# Altium schematic sheet Connectors.SchDoc
size A
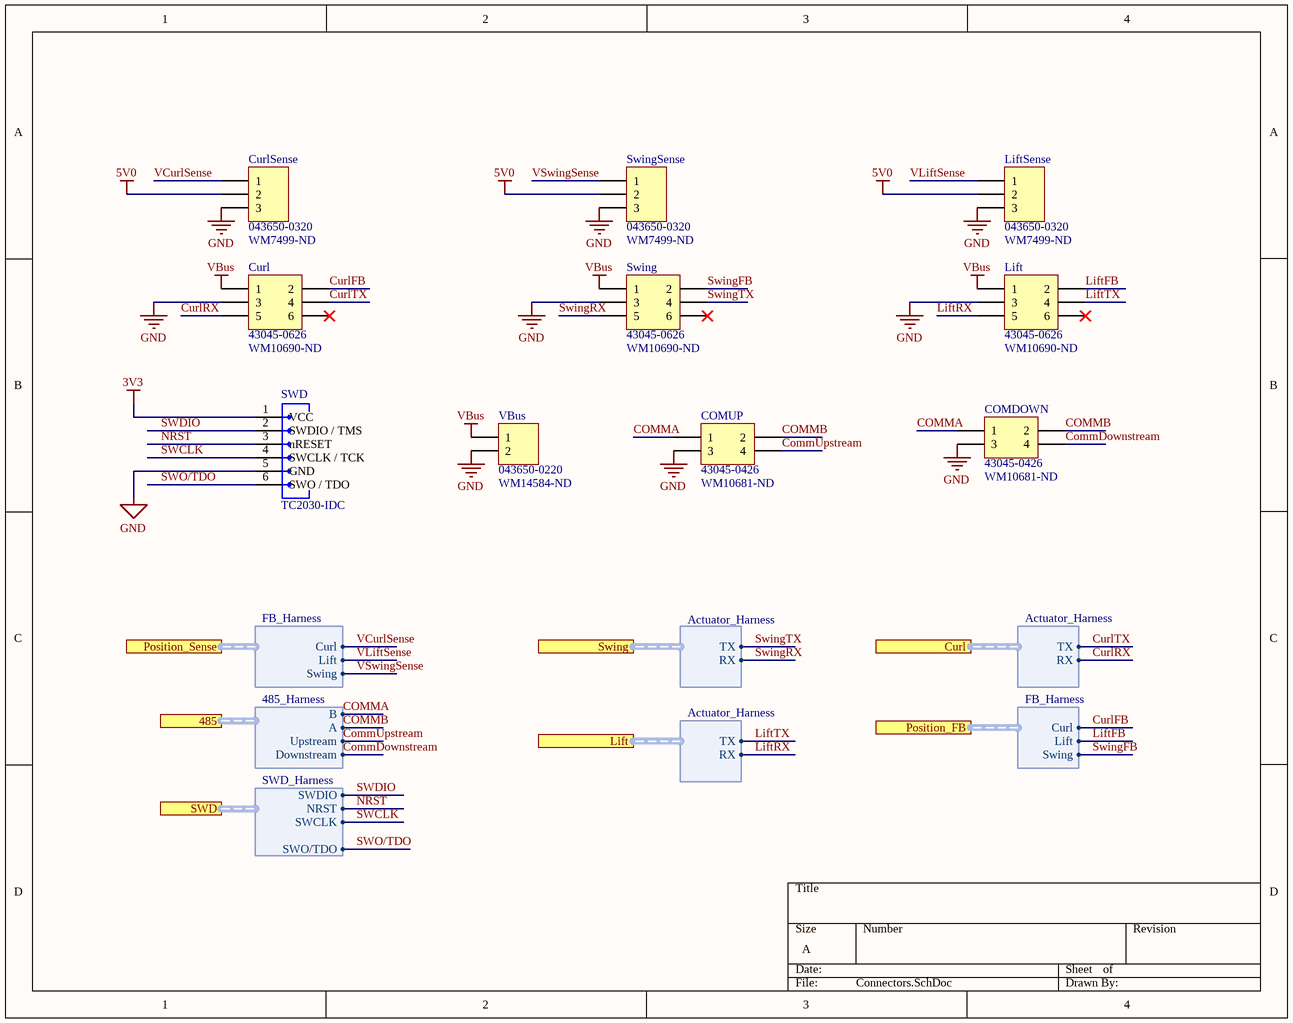
[diagram p0: Connectors.SchDoc]

## Parts
COMDOWN  43045-0426  Vendor PN: WM10681-ND  [43045-0426]
COMUP  43045-0426  Vendor PN: WM10681-ND  [43045-0426]
Curl  43045-0626  Vendor PN: WM10690-ND  [43045-0626]
CurlSense  043650-0320  Vendor PN: WM7499-ND  [43650-0320]
Lift  43045-0626  Vendor PN: WM10690-ND  [43045-0626]
LiftSense  043650-0320  Vendor PN: WM7499-ND  [43650-0320]
SWD  TC2030-IDC  [TC2030-MCP]
Swing  43045-0626  Vendor PN: WM10690-ND  [43045-0626]
SwingSense  043650-0320  Vendor PN: WM7499-ND  [43650-0320]
VBus  043650-0220  Vendor PN: WM14584-ND  [43650-0220]

## Ports
485 (harness 485_Harness), Curl (harness Actuator_Harness), Lift (harness Actuator_Harness), Position_FB (harness FB_Harness), Position_Sense (harness FB_Harness), SWD (harness SWD_Harness), Swing (harness Actuator_Harness)

## Harnesses
SWD_Harness: NRST, SWDIO, SWCLK, SWO/TDO
Actuator_Harness: RX, TX
FB_Harness: Lift, Curl, Swing
485_Harness: A, B, Upstream, Downstream

## Nets
3V3: SWD.1(VCC)
5V0: CurlSense.2 LiftSense.2 SwingSense.2
GND: COMDOWN.3 COMUP.3 Curl.3 CurlSense.3 Lift.3 LiftSense.3 SWD.5(GND) Swing.3 SwingSense.3 VBus.2
VBus: Curl.1 Lift.1 Swing.1 VBus.1
COMMA: COMDOWN.1 COMUP.1 ; port 485.B
COMMB: COMDOWN.2 COMUP.2 ; port 485.A
CommDownstream: COMDOWN.4 ; port 485.Downstream
CommUpstream: COMUP.4 ; port 485.Upstream
CurlFB: Curl.2 ; port Position_FB.Curl
CurlRX: Curl.5 ; port Curl.RX
CurlTX: Curl.4 ; port Curl.TX
LiftFB: Lift.2 ; port Position_FB.Lift
LiftRX: Lift.5 ; port Lift.RX
LiftTX: Lift.4 ; port Lift.TX
NRST: SWD.3(nRESET) ; port SWD.NRST
SWCLK: SWD.4(SWCLK_/_TCK) ; port SWD.SWCLK
SWDIO: SWD.2(SWDIO_/_TMS) ; port SWD.SWDIO
SwingFB: Swing.2 ; port Position_FB.Swing
SwingRX: Swing.5 ; port Swing.RX
SwingTX: Swing.4 ; port Swing.TX
SWO/TDO: SWD.6(SWO_/_TDO) ; port SWD.SWO/TDO
VCurlSense: CurlSense.1 ; port Position_Sense.Curl
VLiftSense: LiftSense.1 ; port Position_Sense.Lift
VSwingSense: SwingSense.1 ; port Position_Sense.Swing

Not connected (* = marked no-connect by the designer): Curl 6*; Lift 6*; Swing 6*

## Library data of the parts
COMDOWN COMUP = Header 2X2: Header, 2-Pin, Dual row; LatestRevisionDate: 17-Jul-2002; LatestRevisionNote: Re-released for DXP Platform.; Publisher: Altium Limited
Curl Lift Swing = Header 3X2: Header, 3-Pin, Dual row; LatestRevisionDate: 17-Jul-2002; LatestRevisionNote: Re-released for DXP Platform.; Publisher: Altium Limited
CurlSense LiftSense SwingSense = Header 3: Header, 3-Pin; LatestRevisionDate: 17-Jul-2002; LatestRevisionNote: Re-released for DXP Platform.; Publisher: Altium Limited
SWD = TC2030-IDC: Connector, Pogo-Pin, ARM Cortex; Manufacturer 1: Tag-Connect; Category: Connectors; Manufacturer Part Number 1: TC2030-IDC; DNP: DNP
VBus = Header 2: Header, 2-Pin; LatestRevisionDate: 17-Jul-2002; LatestRevisionNote: Re-released for DXP Platform.; Publisher: Altium Limited